# Altium schematic sheet Sheet2.SchDoc
size A4
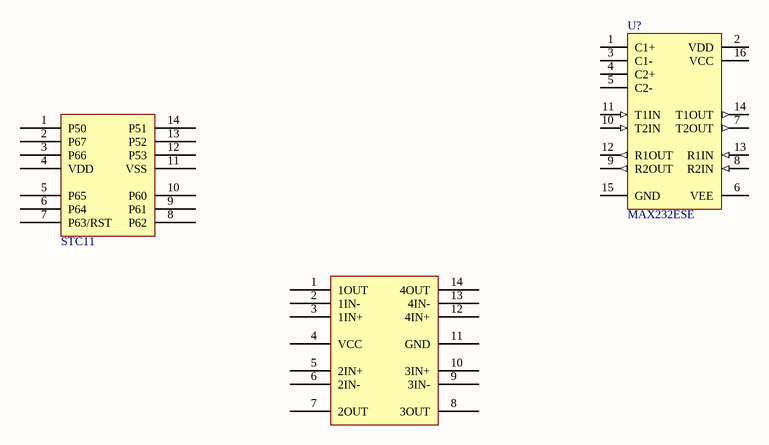
[diagram p0: Sheet2.SchDoc]

## Parts
*  TL074  [DIP14-300_MH]  (value not drawn)
?  STC11  [DIP14-300_MH]
U?  MAX232ESE  [SOIC-16_150mil]

## Nets

Not connected (* = marked no-connect by the designer): * 1(1OUT) 2(1IN-) 3(1IN+) 4(VCC) 5(2IN+) 6(2IN-) 7(2OUT) 8(3OUT) 9(3IN-) 10(3IN+) 11(GND) 12(4IN+) 13(4IN-) 14(4OUT); ? 1(P50) 2(P67) 3(P66) 4(VDD) 5(P65) 6(P64) 7(P63/RST) 8(P62) 9(P61) 10(P60) 11(VSS) 12(P53) 13(P52) 14(P51); U? 1(C1+) 2(VDD) 3(C1-) 4(C2+) 5(C2-) 6(VEE) 7(T2OUT) 8(R2IN) 9(R2OUT) 10(T2IN) 11(T1IN) 12(R1OUT) 13(R1IN) 14(T1OUT) 15(GND) 16(VCC)

## Library data of the parts
U? = MAX232ESE: RS232; ComponentLink1Description: 供应商链接; ComponentLink1URL: http://www.szlcsc.com/product/details_27608.html; Package: SOIC-16_150mil; Supplier: LC; SuppliersPartNumber: C26860